# EAGLE design ext_board (EAGLE 9.5.1)
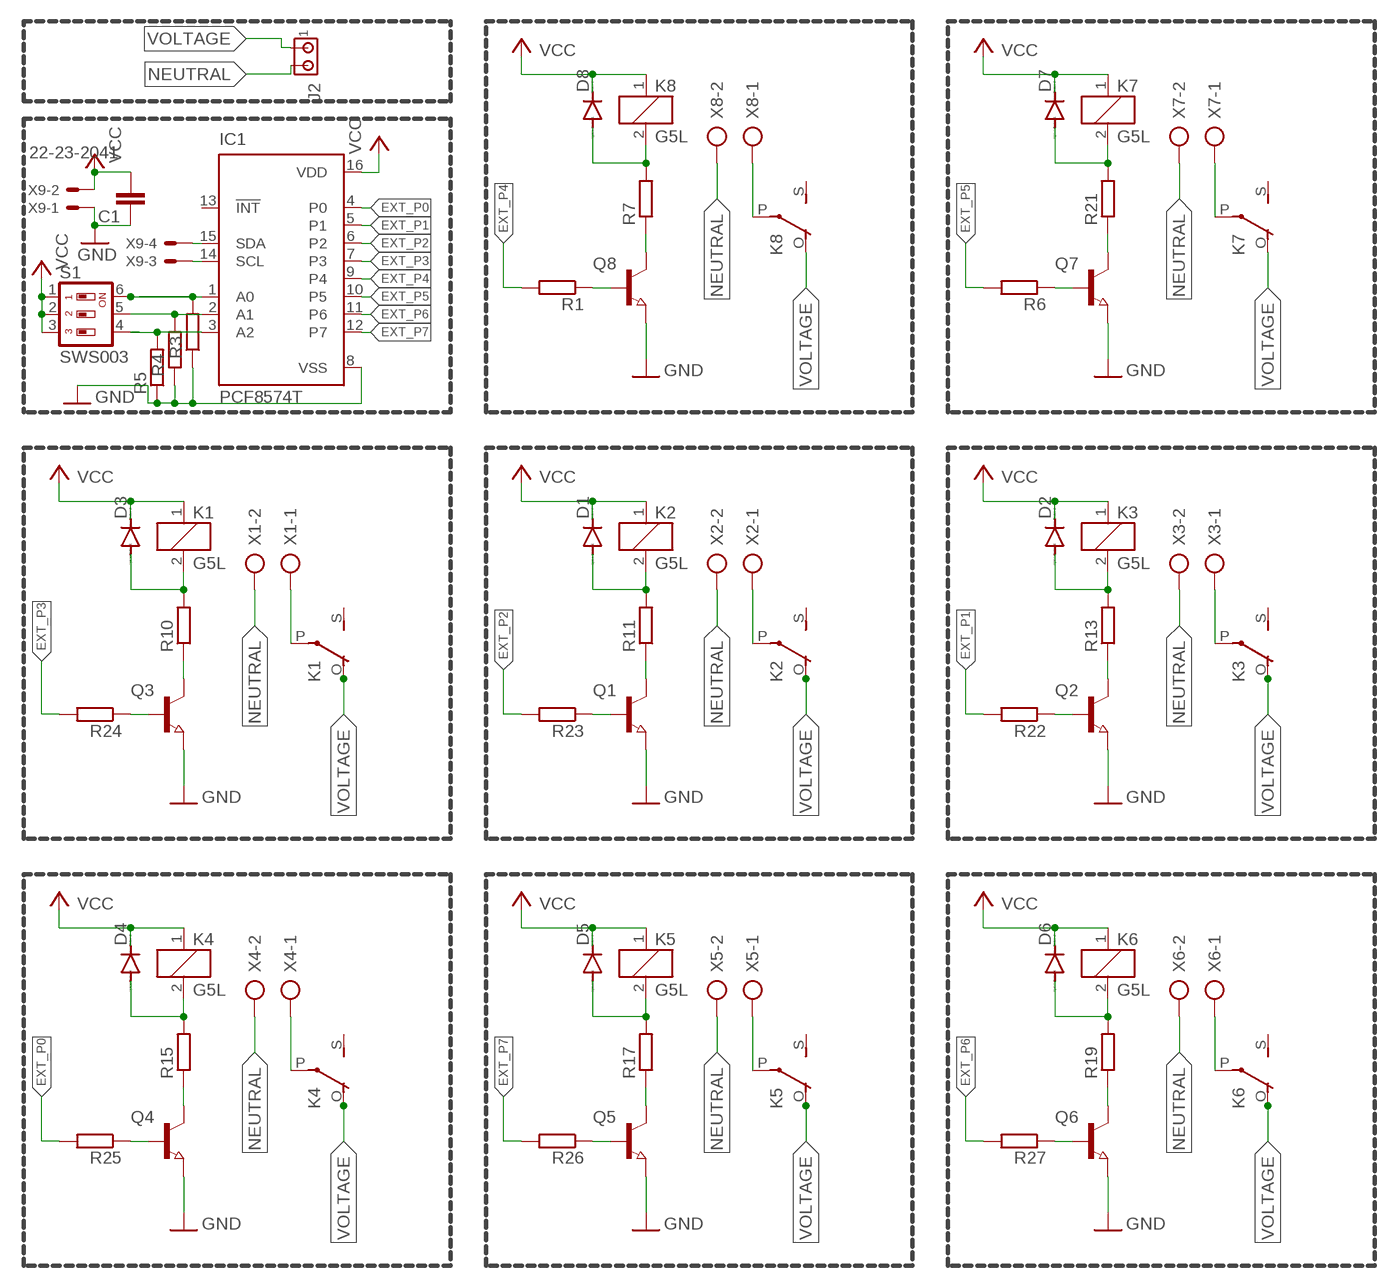
[diagram p0: schematic, sheet 1]

## Parts
C1  C-EUC2012  [C2012]
D1  DIODE-DO-214AC  [DO-214AC]
D2  DIODE-DO-214AC  [DO-214AC]
D3  DIODE-DO-214AC  [DO-214AC]
D4  DIODE-DO-214AC  [DO-214AC]
D5  DIODE-DO-214AC  [DO-214AC]
D6  DIODE-DO-214AC  [DO-214AC]
D7  DIODE-DO-214AC  [DO-214AC]
D8  DIODE-DO-214AC  [DO-214AC]
IC1  PCF8574T  [SO16W]
J2  MTA02-156  [1X2MTA]
K1  G5L  [G5LE]
K2  G5L  [G5LE]
K3  G5L  [G5LE]
K4  G5L  [G5LE]
K5  G5L  [G5LE]
K6  G5L  [G5LE]
K7  G5L  [G5LE]
K8  G5L  [G5LE]
Q1  NPN-TRANSISTOR_SOT23  [SOT23]
Q2  NPN-TRANSISTOR_SOT23  [SOT23]
Q3  NPN-TRANSISTOR_SOT23  [SOT23]
Q4  NPN-TRANSISTOR_SOT23  [SOT23]
Q5  NPN-TRANSISTOR_SOT23  [SOT23]
Q6  NPN-TRANSISTOR_SOT23  [SOT23]
Q7  NPN-TRANSISTOR_SOT23  [SOT23]
Q8  NPN-TRANSISTOR_SOT23  [SOT23]
R1  R-EU_R2010  [R2010]
R3  R-EU_M2012  [M2012]
R4  R-EU_M2012  [M2012]
R5  R-EU_M2012  [M2012]
R6  R-EU_R2010  [R2010]
R7  R-EU_M2012  [M2012]
R10  R-EU_M2012  [M2012]
R11  R-EU_M2012  [M2012]
R13  R-EU_M2012  [M2012]
R15  R-EU_M2012  [M2012]
R17  R-EU_M2012  [M2012]
R19  R-EU_M2012  [M2012]
R21  R-EU_M2012  [M2012]
R22  R-EU_R2010  [R2010]
R23  R-EU_R2010  [R2010]
R24  R-EU_R2010  [R2010]
R25  R-EU_R2010  [R2010]
R26  R-EU_R2010  [R2010]
R27  R-EU_R2010  [R2010]
S1  SWS003  [SMS-003]
X1  AK300/2  [AK300/2]
X2  AK300/2  [AK300/2]
X3  AK300/2  [AK300/2]
X4  AK300/2  [AK300/2]
X5  AK300/2  [AK300/2]
X6  AK300/2  [AK300/2]
X7  AK300/2  [AK300/2]
X8  AK300/2  [AK300/2]
X9  22-23-2041  [22-23-2041]

## Nets
EXT_P0: IC1.4(P0) R25.2
EXT_P1: IC1.5(P1) R22.2
EXT_P2: IC1.6(P2) R23.2
EXT_P3: IC1.7(P3) R24.2
EXT_P4: IC1.9(P4) R1.2
EXT_P5: IC1.10(P5) R6.2
EXT_P6: IC1.11(P6) R27.2
EXT_P7: IC1.12(P7) R26.2
GND: C1.1 IC1.8(VSS) Q1.2(E) Q2.2(E) Q3.2(E) Q4.2(E) Q5.2(E) Q6.2(E) Q7.2(E) Q8.2(E) R3.1 R4.1 R5.1 X9.1
N$10: IC1.2(A1) R4.2 S1.5
N$11: IC1.3(A2) R5.2 S1.4
N$12: IC1.1(A0) R3.2 S1.6
N$15: Q3.1(B) R24.1
N$16: Q1.1(B) R23.1
N$18: D3.A K1.2 R10.2
N$19: Q3.3(C) R10.1
N$20: K1.P(2:P) X1.1
N$22: D1.A K2.2 R11.2
N$23: Q1.3(C) R11.1
N$24: K2.P(2:P) X2.1
N$25: Q2.1(B) R22.1
N$27: D2.A K3.2 R13.2
N$28: Q2.3(C) R13.1
N$29: K3.P(2:P) X3.1
N$30: Q4.1(B) R25.1
N$32: D4.A K4.2 R15.2
N$33: Q4.3(C) R15.1
N$34: K4.P(2:P) X4.1
N$35: Q5.1(B) R26.1
N$37: D5.A K5.2 R17.2
N$38: Q5.3(C) R17.1
N$39: K5.P(2:P) X5.1
N$40: Q6.1(B) R27.1
N$42: D6.A K6.2 R19.2
N$43: Q6.3(C) R19.1
N$44: K6.P(2:P) X6.1
N$45: Q7.1(B) R6.1
N$47: D7.A K7.2 R21.2
N$48: Q7.3(C) R21.1
N$49: K7.P(2:P) X7.1
N$50: Q8.1(B) R1.1
N$52: D8.A K8.2 R7.2
N$53: Q8.3(C) R7.1
N$54: K8.P(2:P) X8.1
NEUTRAL: J2.2 X1.2 X2.2 X3.2 X4.2 X5.2 X6.2 X7.2 X8.2
SCL: IC1.14(SCL) X9.3
SDA: IC1.15(SDA) X9.4
VCC: C1.2 D1.C D2.C D3.C D4.C D5.C D6.C D7.C D8.C IC1.16(VDD) K1.1 K2.1 K3.1 K4.1 K5.1 K6.1 K7.1 K8.1 S1.1 S1.2 S1.3 X9.2
VOLTAGE: J2.1 K1.O(2:O) K2.O(2:O) K3.O(2:O) K4.O(2:O) K5.O(2:O) K6.O(2:O) K7.O(2:O) K8.O(2:O)
Unconnected: IC1.13(!INT) K1.S(2:S) K2.S(2:S) K3.S(2:S) K4.S(2:S) K5.S(2:S) K6.S(2:S) K7.S(2:S) K8.S(2:S)

## Library data of the parts
C1 = rcl:C-EU: CAPACITOR, European symbol; SPICEPREFIX: C
D1-D8 = diode:DIODE-: DIODE
IC1 = micro-philips:PCF8574: I2C-Bus Remote 8-bit I/O expander http://www.semiconductors.philips.com/acrobat_download/datasheets/PCF8574_4.pdf; MPN: PCF8574T/3,512; OC_FARNELL: 1201255; OC_NEWARK: 70R6870
J2 = con-amp:MTA02-156: AMP connector
K1-K8 = relay:G5L: RELAY 1 x switch, 10 A/120 V AC, 8 A/30 V ADC, Omron; OC_FARNELL: unknown; OC_NEWARK: unknown
Q1-Q8 = semicon-smd-ipc:NPN-TRANSISTOR_: NPN TRANSISTOR
R1 R3-R7 R10 R11 R13 R15 R17 R19 R21-R27 = rcl:R-EU_: RESISTOR, European symbol; SPICEPREFIX: R
S1 = smd-special:SWS003: SMD Dip Switch 3 pol.
X1-X8 = con-ptr500:AK300/2: CONNECTOR; OC_FARNELL: unknown; OC_NEWARK: unknown
X9 = con-molex:22-23-2041: .100" (2.54mm) Center Header - 4 Pin; MF: MOLEX; MPN: 22-23-2041; OC_FARNELL: 1462920; OC_NEWARK: 38C0355

## Board
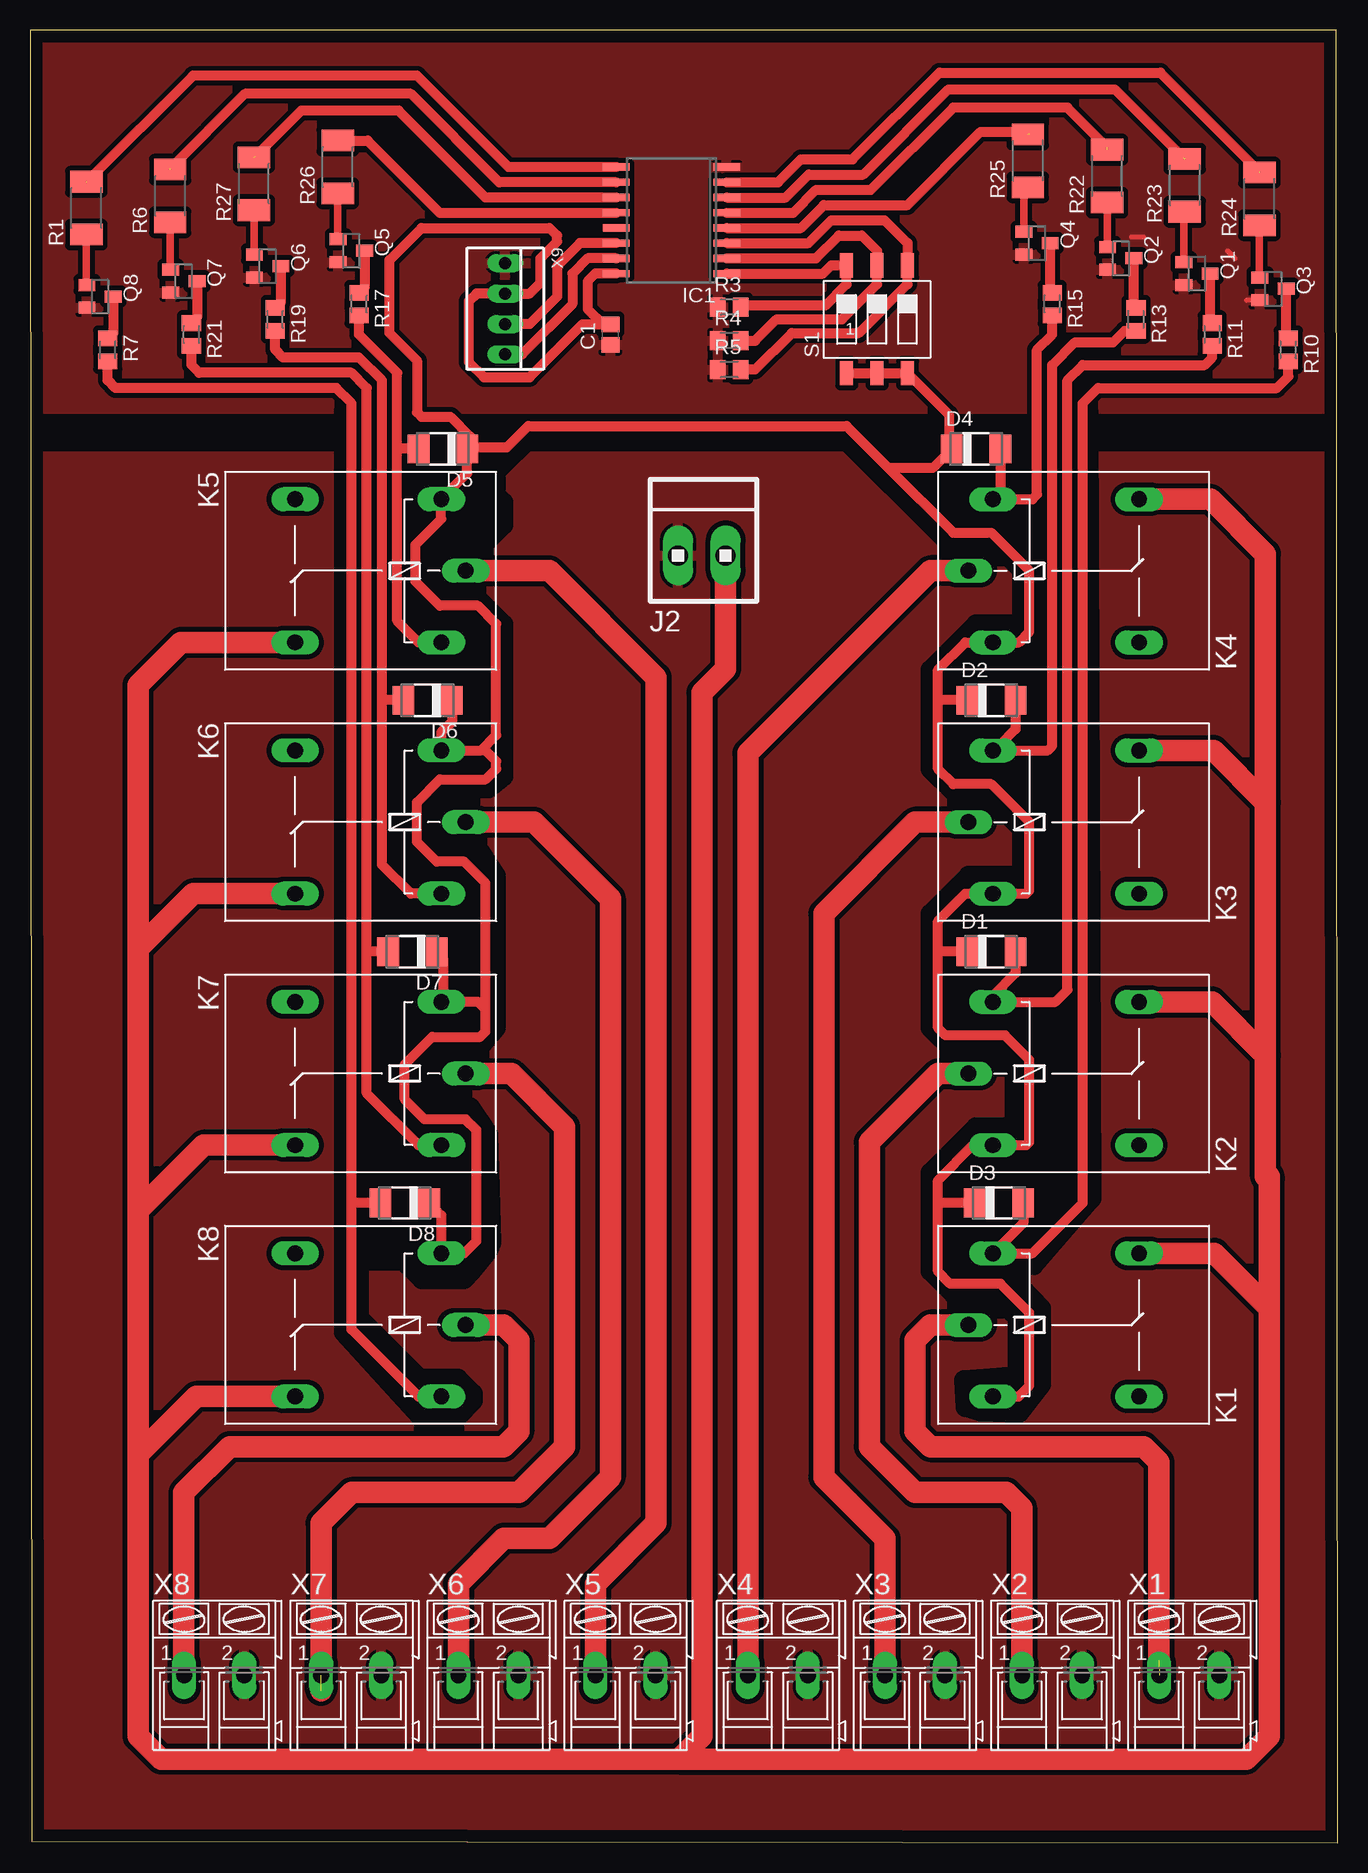
[diagram p1: board, top side]

Size 109.02 x 151.12 mm. Coordinates in mm from the lower left corner, seen from the top.
Outline: 0.13,0.13 109.02,0 108.89,151.12 0,151.12 0.13,0.13
Copper layers (1*16): Top 0.035mm / dielectric 1.5mm / Bottom 0.035mm
Design rules "default": minimum track width 6mil, minimum drill 0.35mm, track to track 6mil, track to pad 6mil, pad to pad 6mil, via to via 6mil, smd to smd 6mil, copper to edge 40mil, drill to drill 6mil, minimum pad ring 10mil, minimum via ring 8mil, stop-mask expansion 4mil, vias tented up to drill 0mil, thermal gap 10mil
tRestrict: 79 lines

### Footprints (pad centres in the part's own frame; a part is rotated, then mirrored left to right if it is on the bottom)
C2012 = smd 1.3 x 1.5: 1 -0.85,0; 2 0.85,0
DO-214AC = smd 1.8 x 2.4: A 2.025,0; C -2.025,0
SO16W = smd 0.6 x 2.2: 1 -4.445,-4.6; 2 -3.175,-4.6; 3 -1.905,-4.6; 4 -0.635,-4.6; 5 0.635,-4.6; 6 1.905,-4.6; 7 3.175,-4.6; 8 4.445,-4.6; 9 4.445,4.6; 10 3.175,4.6; 11 1.905,4.6; 12 0.635,4.6; 13 -0.635,4.6; 14 -1.905,4.6; 15 -3.175,4.6; 16 -4.445,4.6
1X2MTA = drill 1.676 long: 1 1.981,0; 2 -1.981,0
G5LE = drill 1.321 long: 1 -7.493,-5.969; 2 -7.493,5.969; O 4.699,5.969; P -9.525,0; S 4.699,-5.969
SOT23 = smd 1 x 1.4: 1 -0.95,-1.1; 2 0.95,-1.1; 3 0,1.1
R2010 = smd 1.8 x 2.7: 1 -2.2,0; 2 2.2,0
M2012 = smd 1.3 x 1.6: 1 -0.95,0; 2 0.95,0
SMS-003 = smd 1.092 x 2.007: 1 -2.54,-4.496; 2 0,-4.496; 3 2.54,-4.496; 4 2.54,4.496; 5 0,4.496; 6 -2.54,4.496
AK300/2 = drill 1.321 long: 1 -2.515,0; 2 2.489,0
22-23-2041 = drill 1 long: 1 -3.81,0; 2 -1.27,0; 3 1.27,0; 4 3.81,0

### Placement (x,y rotation side)
C1  48.39,125.73 90 top
D1  80.14,74.29 0 top
D2  80.14,95.25 0 top
D3  80.77,53.34 0 top
D4  78.87,116.2 0 top
D5  34.42,116.2 180 top
D6  33.15,95.25 180 top
D7  31.88,74.29 180 top
D8  31.24,53.34 180 top
IC1  53.47,135.25 90 top
J2  56.01,107.31 0 top
K1  87.76,43.18 0 top
K2  87.76,64.13 0 top
K3  87.76,85.09 0 top
K4  87.76,106.04 0 top
K5  26.8,106.04 180 top
K6  26.8,85.09 180 top
K7  26.8,64.13 180 top
K8  26.8,43.18 180 top
Q1  97.28,130.81 270 top
Q2  90.93,132.08 270 top
Q3  103.63,129.54 270 top
Q4  83.95,133.35 270 top
Q5  26.8,132.72 270 top
Q6  19.81,131.44 270 top
Q7  12.83,130.18 270 top
Q8  5.84,128.91 270 top
R1  4.7,136.27 90 top
R3  58.29,128.02 0 top
R4  58.29,125.22 0 top
R5  58.29,122.81 0 top
R6  11.68,137.29 90 top
R7  6.48,124.46 270 top
R10  104.9,124.46 270 top
R11  98.55,125.73 270 top
R13  92.2,127 270 top
R15  85.22,128.27 270 top
R17  27.43,128.27 270 top
R19  20.45,127 270 top
R21  13.46,125.73 270 top
R22  89.79,138.94 90 top
R23  96.27,138.18 90 top
R24  102.49,137.03 90 top
R25  83.19,140.21 90 top
R26  25.65,139.7 90 top
R27  18.67,138.3 90 top
S1  70.61,127 0 top
X1  96.65,13.97 0 top
X2  85.22,13.97 0 top
X3  73.79,13.97 0 top
X4  62.36,13.97 0 top
X5  49.66,13.97 0 top
X6  38.23,13.97 0 top
X7  26.8,13.97 0 top
X8  15.37,13.97 0 top
X9  39.62,127.89 270 top

### Tracks (layer width: path | path; a pad name or v marks a point on that pad's centre or on a via)
EXT_P0  (1 unrouted)
  Top 0.813: 83.31,142.43 83.12,142.62 79.25,142.62 73.15,136.53 66.17,136.53 64.26,134.62 IC1.4
EXT_P1  (1 unrouted)
  Top 0.813: 89.79,141.35 86.49,144.65 76.96,144.65 70.1,137.79 65.53,137.79 63.63,135.89 IC1.5
EXT_P2  (1 unrouted)
  Top 0.813: 96.14,140.46 90.42,146.18 76.58,146.18 69.47,139.06 64.9,139.06 62.99,137.16 IC1.6
EXT_P3  (1 unrouted)
  Top 0.813: 102.49,139.32 94.23,147.57 75.82,147.57 68.58,140.34 64.26,140.34 62.36,138.43 IC1.7
EXT_P4  (1 unrouted)
  Top 0.813: IC1.9 39.88,139.7 32.26,147.32 13.59,147.32 4.7,138.43
EXT_P5  (1 unrouted)
  Top 0.813: IC1.10 39.12,138.43 31.75,145.8 17.91,145.8 11.68,139.57
EXT_P6  (1 unrouted)
  Top 0.813: IC1.11 37.97,137.16 30.73,144.4 22.61,144.4 18.8,140.59
EXT_P7
  Top 0.813: IC1.12 34.16,135.89 28.15,141.9 R26.2
GND
  Top 0.406: Q3.2 101.41,128.59 | 100.46,132.08 99.82,132.72 | 96.33,129.86 Q1.2 | 92.84,133.86 91.82,133.86 | 89.98,131.13 Q2.2 | 82.87,132.4 Q4.2 | 11.66,129.16 Q7.2 12,129.22 | Q6.2 18.86,130.5
  pour Top (isolate 0.406): -0.76,151.76 112.39,151.76 112.39,119.51 -0.76,119.51
N$10
  Top 0.813: IC1.2 65.53,132.08 67.44,133.98 69.34,133.98 70.61,132.72 S1.5 70.61,129.92 67.69,127 62.23,127 60.45,125.22 R4.2
N$11
  Top 0.813: IC1.3 64.9,133.35 66.8,135.25 71.25,135.25 73.15,133.35 S1.4 73.15,129.92 69.09,125.86 63.5,125.86 60.45,122.81 R5.2
N$12
  Top 0.813: IC1.1 66.12,130.81 66.8,131.5 S1.6 68.07,129.92 66.29,128.14 59.37,128.14 R3.2
N$15
  Top 0.61: Q3.1 102.49,130.53 R24.1
  Top 0.813: Q3.1 102.36,130.66
N$16
  Top 0.61: Q1.1 96.18,135.89 R23.1
  Top 0.813: Q1.1 96.01,131.93
N$18
  Top 0.813: D3.A 82.8,51.68 K1.2 83.57,49.15 87.76,53.34 87.76,120.01 89.03,121.28 103.95,121.28 104.9,122.24 R10.2
N$19
  Top 0.813: R10.1 104.73,125.58 Q3.3
N$20  (1 unrouted)
  Top 1.778: K1.P 75.06,43.18 73.79,41.91 73.79,34.29 75.06,33.02 92.84,33.02 94.11,31.75 94.11,15.24
N$22
  Top 0.813: D1.A 82.16,72.51 80.26,70.61 K2.2 85.47,70.1 86.49,71.12 86.49,121.92 87.76,123.19 97.92,123.19 98.55,123.82 R11.2
N$23
  Top 0.813: R11.1 98.38,126.85 Q1.3
N$24
  Top 1.778: K2.P 75.69,64.13 69.98,58.42 69.98,33.02 73.79,29.21 81.41,29.21 82.68,27.94 82.68,13.97 X2.1
N$25
  Top 0.61: Q2.1 89.83,136.69 R22.1
  Top 0.813: Q2.1 89.66,133.2
N$27
  Top 0.813: K3.2 80.77,91.06 | 80.77,91.06 84.84,91.06 85.22,91.44 85.22,123.19 87.12,125.09 90.3,125.09 91.25,126.05 R13.2 | D2.A 82.16,92.83 80.77,91.44 80.77,91.06
N$28
  Top 0.813: R13.1 92.03,128.12 Q2.3
N$29
  Top 1.778: K3.P 73.79,85.09 66.17,77.47 66.17,30.48 71.27,25.38 X3.1
N$30
  Top 0.61: Q4.1 82.85,137.67 R25.1
  Top 0.813: Q4.1 82.68,134.47
N$32
  Top 0.813: D4.A 80.89,112.64 K4.2 83.57,112.01 83.95,112.4 83.95,124.46 85.22,125.73 R15.2
N$33
  Top 0.813: R15.1 85.05,129.39 Q4.3
N$34
  Top 1.778: K4.P 75.06,106.04 59.84,90.83 X4.1
N$35
  Top 0.61: R26.1 25.65,133.96 25.53,133.84
  Top 0.813: 25.53,133.84 Q5.1
N$37
  Top 0.813: K5.2 32.38,100.08 30.61,101.85 30.61,116.2 | D5.A 30.61,116.2 | R17.2 27.43,125.73 30.61,122.56 30.61,116.2
N$38
  Top 0.813: Q5.3 27.9,129.69 R17.1
N$39
  Top 1.778: X5.1 47.14,21.61 52.2,26.67 52.2,97.16 43.31,106.04 K5.P
N$40
  Top 0.61: R27.1 18.67,132.69 18.54,132.56
  Top 0.813: 18.54,132.56 Q6.1
N$42
  Top 0.813: K6.2 31.75,79.12 29.34,81.53 29.34,95.25 | D6.A 29.34,95.25 | R19.2 20.45,124.46 21.08,123.82 27.43,123.82 29.34,121.92 29.34,95.25
N$43
  Top 0.813: Q6.3 20.91,128.41 R19.1
N$44
  Top 1.778: K6.P 42.04,85.09 48.39,78.74 48.39,30.48 43.31,25.4 39.5,25.4 35.71,21.61 X6.1
N$45
  Top 0.61: R6.1 11.68,131.42 11.56,131.29
  Top 0.813: 11.56,131.29 Q7.1
N$47
  Top 0.813: K7.2 32.38,58.17 28.07,62.48 28.07,74.29 | 28.07,74.29 28.07,121.28 26.8,122.56 14.1,122.56 13.46,123.19 R21.2 | D7.A 28.07,74.29
N$48
  Top 0.813: Q7.3 13.93,127.15 R21.1
N$49  (1 unrouted)
  Top 1.778: K7.P 40.13,64.13 44.58,59.69 44.58,33.02 40.77,29.21 26.8,29.21 24.26,26.67 24.26,12.7
N$50
  Top 0.61: R1.1 4.7,129.9 Q8.1
  Top 0.813: 4.57,130.03 Q8.1
N$52
  Top 0.813: K8.2 32.38,37.21 26.8,42.8 26.8,53.34 | 26.8,53.34 26.8,120.01 25.53,121.28 7.11,121.28 6.48,121.92 R7.2 | D8.A 26.8,53.34
N$53
  Top 0.813: Q8.3 6.94,125.88 R7.1
N$54
  Top 1.778: K8.P 39.5,43.18 40.77,41.91 40.77,34.29 39.5,33.02 16.64,33.02 12.83,29.21 12.83,13.99 X8.1
NEUTRAL
  pour Top (isolate 0.406): -1.14,115.57 -1.14,-2.54 113.79,-2.54 113.79,115.57
SCL
  Top 0.813: IC1.14 45.85,133.35 43.94,131.44 43.94,128.91 41.66,126.62 X9.3
SDA
  Top 0.813: IC1.15 46.48,132.08 45.21,130.81 45.21,128.27 41.02,124.08 X9.4
VCC
  Top 0.61: 37.47,116.33 37.34,116.2 D5.C 36.57,116.33 36.7,116.33
  Top 0.813: 37.97,69.47 37.97,67.63 37.53,67.18 33.53,67.18 31.24,64.9 31.24,61.98 32.89,60.32 36.32,60.32 37.21,59.44 37.21,50.16 36.2,49.15 K8.1 34.29,52.32 D8.C | 37.97,69.47 37.34,70.1 34.42,70.1 | 34.42,70.1 K7.1 | 37.97,69.47 37.97,80.01 36.2,81.79 33.91,81.79 32.26,83.44 32.26,86.74 34.16,88.65 37.97,88.65 38.86,89.53 38.86,90.17 37.97,91.06 37.59,91.06 | 37.59,91.06 K6.1 34.29,92.58 35.17,93.47 D6.C | 37.59,91.06 38.86,92.33 38.86,101.6 37.34,103.12 34.16,103.12 32.13,105.16 32.13,108.2 34.29,110.36 K5.1 36.44,114.17 D5.C 36.7,115.95 | K1.1 82.42,37.21 83.31,38.1 83.31,44.2 80.9,46.61 76.71,46.61 75.69,47.62 75.69,53.34 | 75.69,53.34 75.69,55.24 78.61,58.17 K2.1 83.06,58.17 83.31,58.42 83.31,65.28 81.28,67.31 76.33,67.31 75.69,67.94 75.69,74.29 | 75.69,74.29 75.69,76.84 77.98,79.12 K3.1 83.06,79.12 83.31,79.38 83.31,85.09 80.14,88.27 76.96,88.27 75.69,89.53 75.69,95.25 | 75.69,95.25 75.69,97.79 77.98,100.08 K4.1 82.42,100.08 83.31,100.97 83.31,106.04 80.14,109.22 76.96,109.22 71.56,114.62 | 71.56,114.62 68.07,118.11 41.53,118.11 39.75,116.33 37.47,116.33 36.7,116.33 36.7,117.22 35.05,118.87 32.64,118.87 32.26,119.25 32.26,123.57 29.97,125.86 29.97,131.95 32.64,134.62 43.31,134.62 43.94,133.98 43.94,133.48 42.55,132.08 42.55,130.05 41.66,129.16 X9.2 37.21,129.16 36.58,128.52 36.58,123.44 37.85,122.17 41.66,122.17 46.06,126.58 47.75,126.58 | D7.C 34.42,73.78 34.42,70.1 | D3.C 75.69,53.34 | D1.C 75.69,74.29 | D2.C 75.69,95.25 | D4.C 76.58,115.95 | 76.58,115.95 75.25,114.62 71.56,114.62 | S1.1 S1.2 S1.3 76.58,119.07 76.58,115.95 | C1.2 47.75,126.58
  Top 0.813: IC1.16 47.12,130.81 46.48,130.18 46.48,127.85 47.75,126.58
VOLTAGE
  Top 1.778: J2.1 57.99,97.87 56.01,95.88 56.01,8.89 54.1,6.98 | 54.1,6.98 10.92,6.98 9.02,8.89 9.02,32.38 | 9.02,32.38 9.02,52.7 | 9.02,52.7 9.02,74.55 | 9.02,74.55 9.02,96.52 12.57,100.08 K5.O | 54.1,6.98 101.4,6.98 103.3,8.89 103.3,44.58 | 103.3,44.58 103.3,55.24 | 103.3,55.57 103.3,55.24 | 103.3,55.24 103,55.55 103,65.66 | K4.O 98.42,112.01 103,107.44 103,86.74 | 103,65.66 103,86.74 | K3.O 98.68,91.06 103,86.74 | K2.O 98.55,70.1 103,65.66 | K1.O 98.73,49.15 103.3,44.58 | K8.O 13.84,37.21 9.02,32.38 | K7.O 14.48,58.17 9.02,52.7 | K6.O 13.59,79.12 9.02,74.55